# Altium schematic sheet Wiznet.SchDoc: Wiznet
size 420 x 297 mm; Author: G.Kasprowicz; CompanyName: WUT ISE; DrawnBy: G.Kasprowicz; Organization: WUT ISE; Address1: PW ISE; Address2: Nowowiejska 15/19 00-665 Warsaw; Address3: gkasprow@gmail.com; DocumentNumber: 11; Revision: 1.0; SheetNumber: 11; SheetTotal: 11; ModifiedBy: -; CheckedDate: -; Title2: Module; DivGrp: WUT ISE; Designer: G.Kasprowicz; ModifiedDate: -; ProjectName: Sensor Box
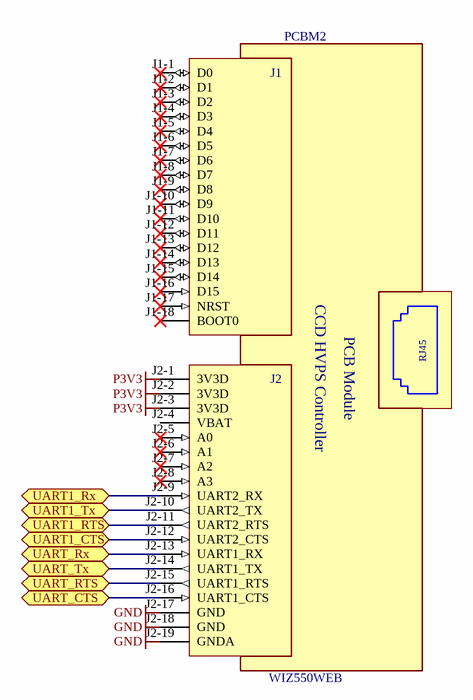
[diagram p0: Wiznet.SchDoc]

## Parts
PCBM2  WIZ550WEB  [PCBM_WIZNET_WIZ550WEB]

## Ports
UART1_CTS (bidir), UART1_RTS (bidir), UART1_Rx (bidir), UART1_Tx (bidir), UART_CTS (bidir), UART_RTS (bidir), UART_Rx (bidir), UART_Tx (bidir)

## Nets
GND: PCBM2.J2-17(GND) PCBM2.J2-18(GND) PCBM2.J2-19(GNDA)
P3V3: PCBM2.J2-1(3V3D) PCBM2.J2-2(3V3D) PCBM2.J2-3(3V3D)
UART1_CTS: PCBM2.J2-12(UART2_CTS) ; port UART1_CTS
UART1_RTS: PCBM2.J2-11(UART2_RTS) ; port UART1_RTS
UART1_Rx: PCBM2.J2-9(UART2_RX) ; port UART1_Rx
UART1_Tx: PCBM2.J2-10(UART2_TX) ; port UART1_Tx
UART_CTS: PCBM2.J2-16(UART1_CTS) ; port UART_CTS
UART_RTS: PCBM2.J2-15(UART1_RTS) ; port UART_RTS
UART_Rx: PCBM2.J2-13(UART1_RX) ; port UART_Rx
UART_Tx: PCBM2.J2-14(UART1_TX) ; port UART_Tx

Not connected (* = marked no-connect by the designer): PCBM2 J1-1(D0)* J1-2(D1)* J1-3(D2)* J1-4(D3)* J1-5(D4)* J1-6(D5)* J1-7(D6)* J1-8(D7)* J1-9(D8)* J1-10(D9)* J1-11(D10)* J1-12(D11)* J1-13(D12)* J1-14(D13)* J1-15(D14)* J1-16(D15)* J1-17(NRST)* J1-18(BOOT0)* J2-4(VBAT) J2-5(A0)* J2-6(A1)* J2-7(A2)* J2-8(A3)*

## Notes on the sheet
- Project/Equipment
- Document
- Designer
- Drawn by
- Check.by
- Copyright WUT ISE 2018.
  This documentation describes Open Hardware and is licensed under the CERN OHL v.1.1. You may redistribute and modify this documentation under the terms of the CERN OHL v.1.1. (http://ohwr.org/CERNOHL). This documentation is distributed WITHOUT ANY EXPRESS OR IMPLIED WARRANTY, INCLUDING OF MERCHANTABILITY, SATISFACTORY QUALITY AND FITNESS FOR A PARTICULAR PURPOSE. Please see the CERN OHL v.1.1 for applicable conditions.
- Contact
- File
- Last Mod.
- Print Date
- Sheet
- Size
- A3
- of
- Rev
- (in symbol PCBM_WIZNET_WIZ550WEB) J1; RJ45; J2; CCD HVPS Controller; PCB Module

## Library data of the parts
PCBM2 = PCBM_WIZNET_WIZ550WEB: Embedded Web Server Module base on W5500 TCP/IP Chip; Manufacturer: WIZNET; PressFit: No; Bonding: No; Part Number: PCBM_WIZNET_WIZ550WEB; Component Kind: Standard; Component Type: Standard; Device: WIZ550WEB; PackageDescription: Embedded Web Server Module base on W5500 TCP/IP Chip; Part Description: Embedded Web Server Module base on W5500 TCP/IP Chip; Manufacturer Part Number: WIZ550WEB; Pin Count: 37; Mounted: Yes; Socket: No; SMD: No; Sense: No; ComponentHeight: 24.5mm; Author: CERN DEM MR; HelpURL: \\cern.ch\dfs\Applications\Altium\Datasheets\PCBM_WIZNET_WIZ550WEB.pdf; CreateDate: 20/07/2016; LatestRevisionDate: 20/07/2016